# EAGLE schematic WifiDongle (EAGLE 7.7.0)
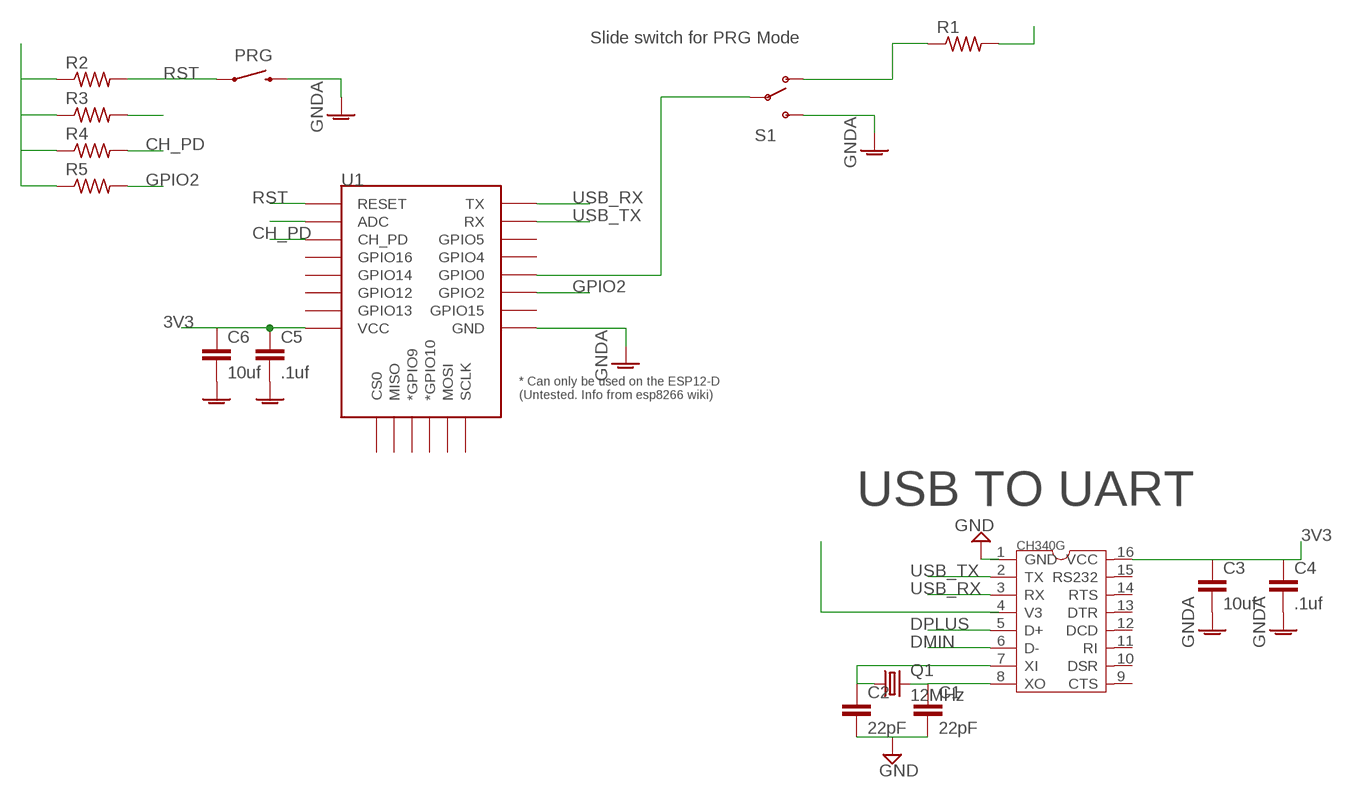
[diagram p0: schematic, sheet 1]

## Parts
C1  22pF  CAP0603-CAP  [0603-CAP]
C2  22pF  CAP0603-CAP  [0603-CAP]
C3  10uf  CAP0603-CAP  [0603-CAP]
C4  .1uf  CAP0603-CAP  [0603-CAP]
C5  .1uf  CAP0603-CAP  [0603-CAP]
C6  10uf  CAP0603-CAP  [0603-CAP]
CH340G  CH340GCH340G  [SOP-16]
PRG  SWITCH-MOMENTARY-2SMD-REDUNDANT  [TACTILE-SWITCH-SMD]
Q1  12MHz  CRYSTALHC49U70  [HC49U70]
R1  R-US_R0603  [R0603]
R2  R-US_R0603  [R0603]
R3  R-US_R0603  [R0603]
R4  R-US_R0603  [R0603]
R5  R-US_R0603  [R0603]
S1  SWITCH-SPDT-SMD-A  [SWITCH-SPST-SMD-A]
U1  ESP12ESMD  [ESP12E-SMD]

## Nets
3V3: C3.1 C4.1 C5.1 C6.1 CH340G.16(VCC) U1.VCC
CH_PD: R4.2 U1.CH_PD
DMIN: CH340G.6(D-)
DPLUS: CH340G.5(D+)
GND: C1.2 C2.2 CH340G.1(GND)
GNDA: C3.2 C4.2 C5.2 C6.2 PRG.3 PRG.4 S1.3(S) U1.GND
GPIO2: R5.2 U1.GPIO2
N$3: S1.2(P) U1.GPIO0
N$4: R1.1 S1.1(O)
N$5: R1.2
N$7: R2.1 R3.1 R4.1 R5.1
N$9: R3.2
N$11: U1.ADC
RST: PRG.1 PRG.2 R2.2 U1.RESET
USB_RX: CH340G.3(RX) U1.TXD0(TX)
USB_TX: CH340G.2(TX) U1.RXD0(RX)
XI: C2.1 CH340G.7(XI) Q1.1
XO: C1.1 CH340G.8(XO) Q1.2
Unconnected: CH340G.4(V3) CH340G.9(CTS) CH340G.10(DSR) CH340G.11(RI) CH340G.12(DCD) CH340G.13(DTR) CH340G.14(RTS) CH340G.15(RS232) U1.CS0 U1.GPIO4 U1.GPIO5 U1.GPIO9(*GPIO9) U1.GPIO10(*GPIO10) U1.GPIO12 U1.GPIO13 U1.GPIO14 U1.GPIO15 U1.GPIO16 U1.MISO U1.MOSI U1.SCLK

## Notes on the sheet
- Slide switch for PRG Mode
- USB TO UART

## Library data of the parts
C1-C6 = SparkFun-Capacitors:CAP: Capacitor Standard 0603 ceramic capacitor, and 0.1" leaded capacitor.
CH340G = digital-ic:CH340G: USB to Serial CH340G
PRG = SparkFun-Electromechanical:SWITCH-MOMENTARY-2: Various NO switches- pushbuttons, reed, etc
Q1 = crystal:CRYSTAL: CRYSTAL; OC_FARNELL: unknown; OC_NEWARK: unknown
R1-R5 = resistor:R-US_: RESISTOR, American symbol
S1 = SparkFun-Electromechanical:SWITCH-SPDT: SPDT Switch Simple slide switch, Spark Fun Electronics SKU : COM-00102 DPDT SMT slide switch, AYZ0202, SWCH-08179
U1 = esp8266modules:ESP12E: ESP12E Module